# Altium schematic sheet P01_top.SchDoc
size A
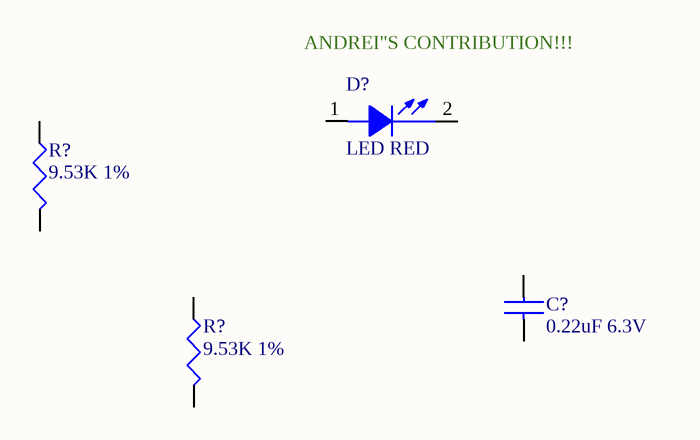
[diagram p0: P01_top.SchDoc]

## Parts
(Parts that share a designator on the sheet are numbered #1, #2 ... from top to bottom, then left to right.)
C?  0.22uF 6.3V  [0201]
D?  LED RED  [LED0603_LNJ337W83RA]
R?#1  9.53K 1%  [0402]
R?#2  9.53K 1%  [0402]

## Nets

Not connected (* = marked no-connect by the designer): C? 1 2; D? 1(Anode) 2(Cathode); R?#1 1 2; R?#2 1 2

## Notes on the sheet
- (near D?) ANDREI"S CONTRIBUTION!!!

## Library data of the parts
C? = C0201_0.22uF_6V: CAP CER 0.22UF 6.3V 20% X5R 0201; Mfg: TDK; Vendor: Digi-Key; Vendor_PN: 445-5929-1-ND; Mfg_PN: C0603X5R0J224M030BB; Price1k: 0.0275; RoHS: Yes; Price100: 0.0475; Price1: 0.15
D? = LED_0603_RED: LED RED HIGH BRIGHT ESS SMD; Mfg: Panasonic; Vendor: Digikey; Vendor_PN: LNJ237W82RACT-ND; Mfg_PN: LNJ237W82RA; Price1k: 0.08816; RoHS: Yes; Price1: 0.48; Price100: 0.2031; Supplier 1: Digi-Key; Supplier 2: Farnell; Supplier Part Number 1: LNJ237W82RACT-ND; Supplier Part Number 2: 1908052
R?#1 R?#2 = R0402_9.53K_1%: RES 9.53K OHM 1/10W 1% 0402 SMD; Mfg_PN: ERJ-2RKF9531X; Mfg: Panasonic; Vendor: Digikey; Vendor_PN: P9.53KLCT-ND; Price1k: 0.00672; RoHS: Yes; Price100: 0.0184; Price1: 0.06; Supplier 1: Digi-Key; Supplier Part Number 1: P9.53KLDKR-ND